# EAGLE design BB8_Head (EAGLE 9.2.2)
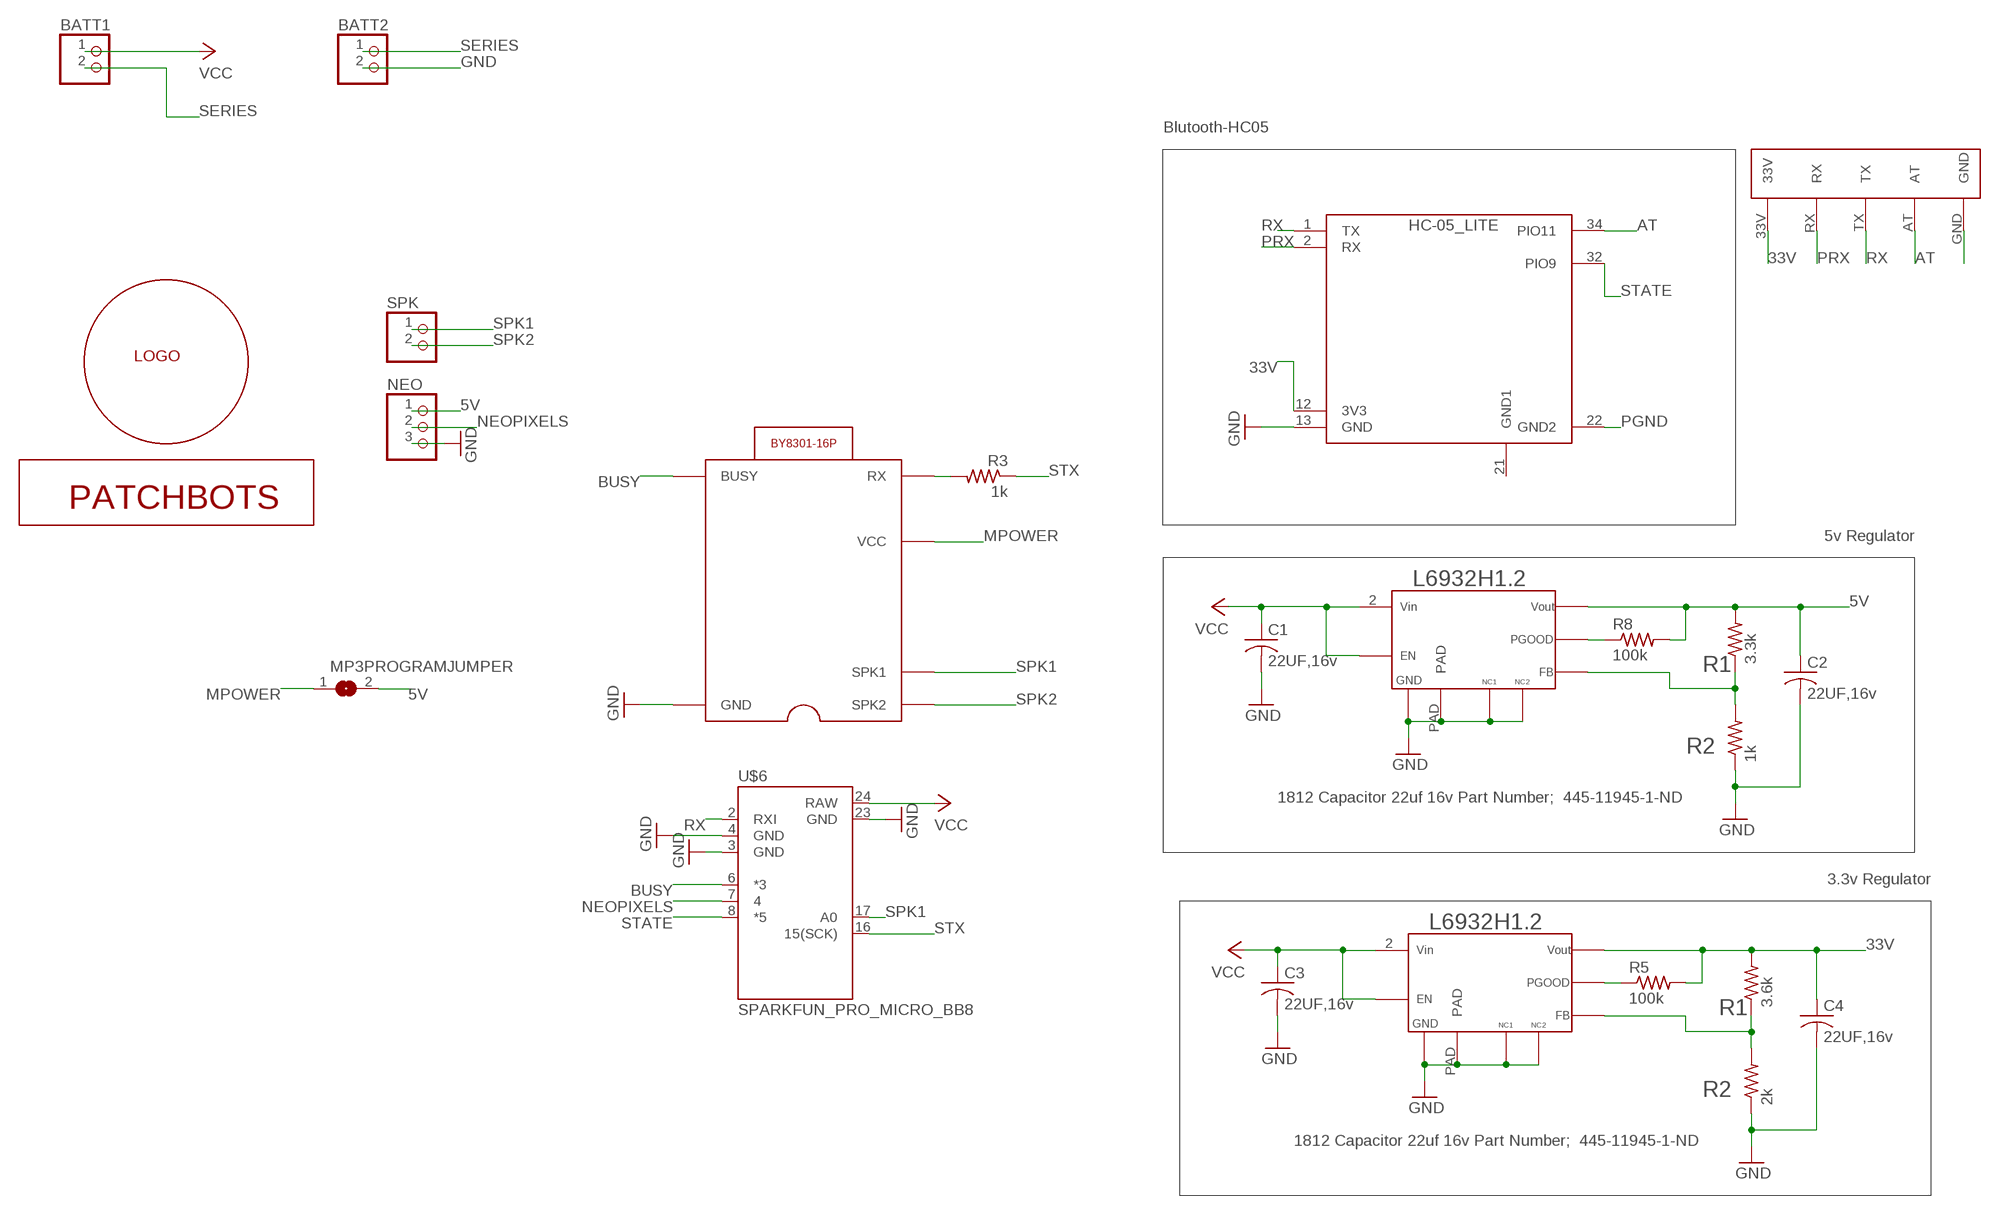
[diagram p0: schematic, sheet 1]

## Parts
BATT1  PINHD-1X2  [1X02]
BATT2  PINHD-1X2  [1X02]
C1  22UF,16v  C-USC1812  [C1812]
C2  22UF,16v  C-USC1812  [C1812]
C3  22UF,16v  C-USC1812  [C1812]
C4  22UF,16v  C-USC1812  [C1812]
HC-05  HC-05_LITE  [BLUETOOTH_SMD_LITE]
MP3PROGRAMJUMPER  SJ  [SJ]
NEO  PINHD-1X3  [1X03]
R1  3.3k  R-US_R2010  [R2010]
R3  1k  R-US_R2010  [R2010]
R5  100k  R-US_R2010  [R2010]
R6  3.6k  R-US_R2010  [R2010]
R7  2k  R-US_R2010  [R2010]
R8  100k  R-US_R2010  [R2010]
R9  1k  R-US_R2010  [R2010]
SPK  PINHD-1X2  [1X02]
U$2  LOGO_15MM-MIXED  [LOGO_15MM_MIXED]
U$3  L6932H1.2  [L6932H1]
U$4  PATCHBOTS_SPLIT15MM  [PATCHBOTS_SPLIT15MM]
U$5  L6932H1.2  [L6932H1]
U$6  SPARKFUN_PRO_MICRO_BB8  [SPARKFUN_PRO_MICRO_BB8]
U$7  PROGRAMMER  [BLUETOOTH_SMD_PROGRAMMER]
U$8  BY8301_BB8  [BY8301-16P_BB8]

## Nets
5V: C2.1 MP3PROGRAMJUMPER.2 NEO.1 R1.2 R8.2 U$3.4
33V: C4.1 HC-05.12(3V3) R5.2 R6.2 U$5.4 U$7.33V
AT: HC-05.34(PIO11) U$7.AT
BUSY: U$6.6(*3) U$8.BUSY
GND: BATT2.2 C1.2 C2.2 C3.2 C4.2 HC-05.13(GND) NEO.3 R7.1 R9.1 U$3.6 U$3.7 U$3.8 U$3.PAD U$5.6 U$5.7 U$5.8 U$5.PAD U$6.3(GND) U$6.4(GND) U$6.23(GND) U$8.GND
MPOWER: MP3PROGRAMJUMPER.1 U$8.VCC
N$1: R1.1 R9.2 U$3.3
N$3: R8.1 U$3.5
N$6: R5.1 U$5.5
N$7: R6.1 R7.2 U$5.3
N$11: R3.2 U$8.RX
NEOPIXELS: NEO.2 U$6.7
PGND: HC-05.22(GND2) U$7.GND
PRX: HC-05.2(RX) U$7.RX
RX: HC-05.1(TX) U$6.2(RXI) U$7.TX
SERIES: BATT1.2 BATT2.1
SPK1: SPK.1 U$6.17(A0) U$8.SPK1
SPK2: SPK.2 U$8.SPK2
STATE: HC-05.32(PIO9) U$6.8(*5)
STX: R3.1 U$6.16(15(SCK))
VCC: BATT1.1 C1.1 C3.1 U$3.1 U$3.2 U$5.1 U$5.2 U$6.24(RAW)
Unconnected: HC-05.21(GND1)

## Notes on the sheet
- Blutooth-HC05
- 5v Regulator
- R1
- R2
- 1812 Capacitor 22uf 16v Part Number;  445-11945-1-ND
- 3.3v Regulator
- R1
- R2
- 1812 Capacitor 22uf 16v Part Number;  445-11945-1-ND

## Library data of the parts
BATT1 BATT2 SPK = pinhead:PINHD-1X2: PIN HEADER
C1-C4 = adafruit:C-US: CAPACITOR, American symbol
HC-05 = HC-05:HC-05_LITE
MP3PROGRAMJUMPER = jumper:SJ: SMD solder JUMPER
NEO = pinhead:PINHD-1X3: PIN HEADER
R1 R3 R5-R9 = adafruit:R-US_: RESISTOR, American symbol
U$2 = LOGO:LOGO_15MM-MIXED
U$3 U$5 = L6932H12:L6932H1.2
U$4 = LOGO:PATCHBOTS_SPLIT15MM
U$6 = SparkFun-Boards:SPARKFUN_PRO_MICRO_BB8
U$7 = HC-05:PROGRAMMER
U$8 = BY8301-16P_MP3Player:BY8301_BB8

## Board
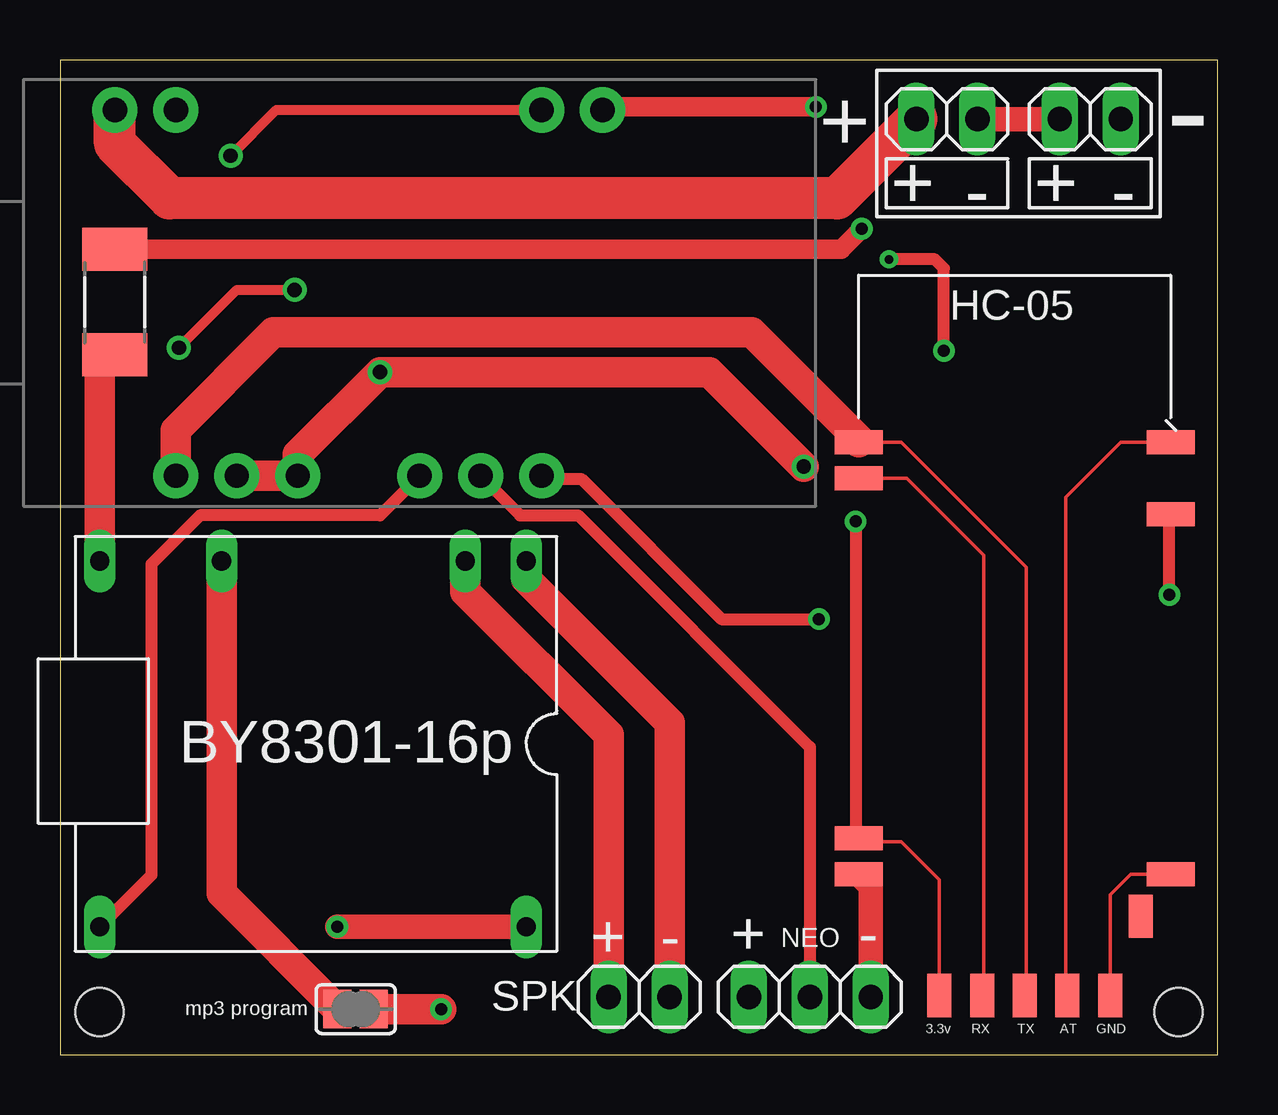
[diagram p1: board, top side]
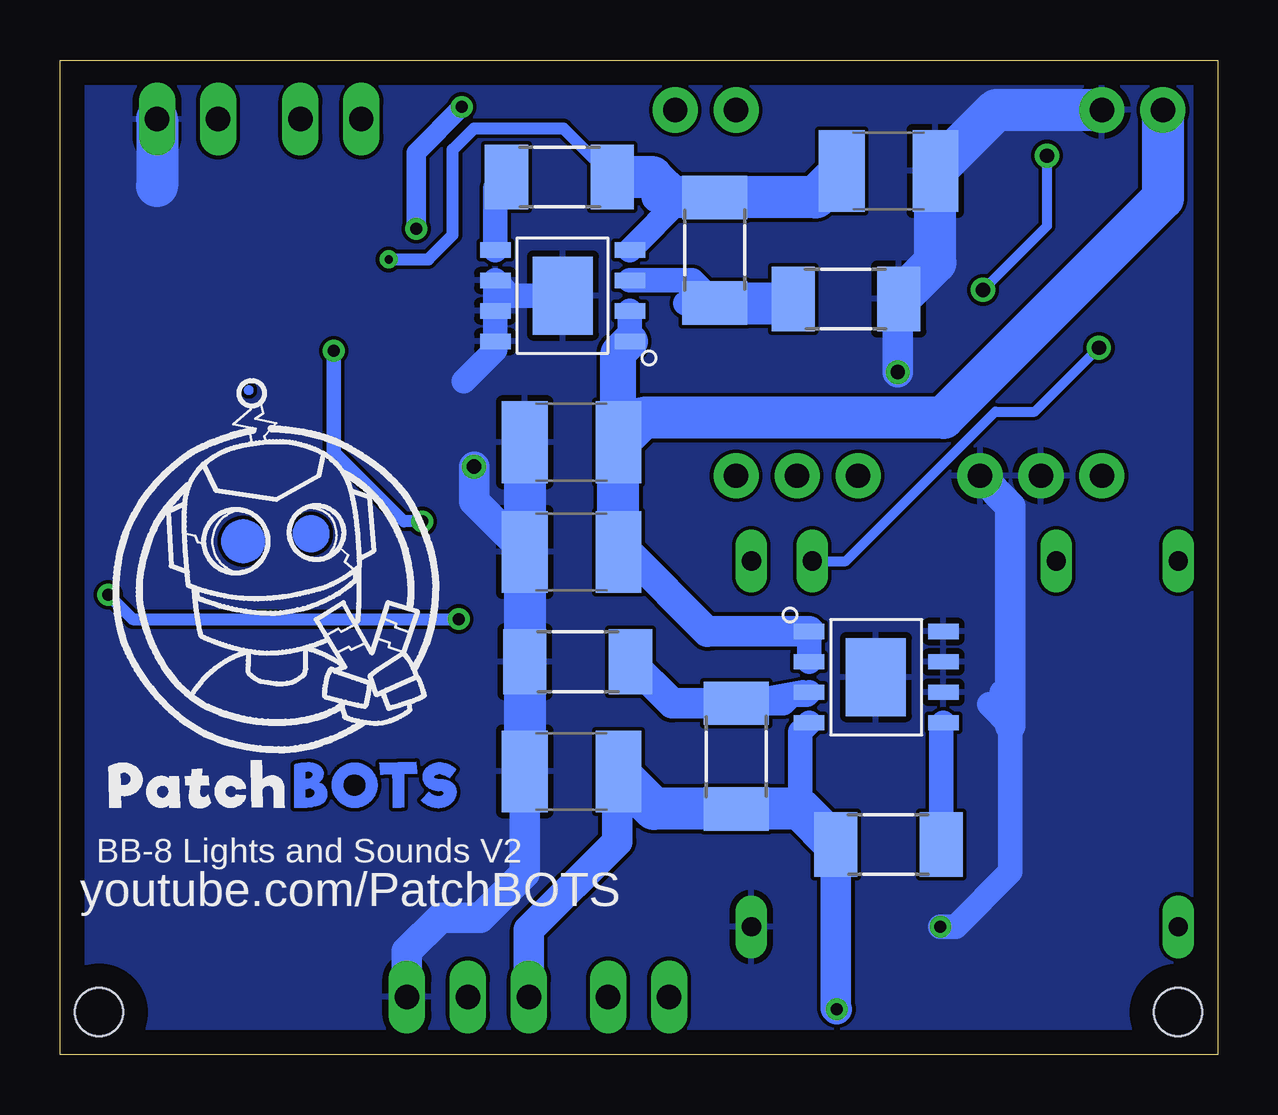
[diagram p2: board, bottom side, seen from below]

Size 48.24 x 41.45 mm. Coordinates in mm from the lower left corner, seen from the top.
Outline: 0,0 48.24,0 48.24,41.45 0,41.45 0,0
Copper layers (1*16): Top 0.035mm / dielectric 1.5mm / Bottom 0.035mm
Design rules "default": minimum track width 6mil, minimum drill 0.35mm, track to track 6mil, track to pad 6mil, pad to pad 6mil, via to via 6mil, smd to smd 6mil, copper to edge 40mil, drill to drill 6mil, minimum pad ring 10mil, minimum via ring 8mil, stop-mask expansion 4mil, vias tented up to drill 0mil, thermal gap 10mil
Holes 2 mm at 1.65,1.78 46.61,1.78

### Footprints (pad centres in the part's own frame; a part is rotated, then mirrored left to right if it is on the bottom)
1X02 = drill 1.016 long: 1 -1.27,0; 2 1.27,0
C1812 = smd 1.9 x 3.4: 1 -1.95,0; 2 1.95,0
BLUETOOTH_SMD_LITE = smd 2 x 1: 1 -6.35,3.81; 2 -6.35,2.31; 12 -6.35,-12.69; 13 -6.35,-14.19; 22 6.65,-14.19; 32 6.65,0.81; 34 6.65,3.81 | smd 1 x 1.8: 21 5.4,-15.94
SJ = smd 1.168 x 1.6: 1 -0.762,0; 2 0.762,0
1X03 = drill 1.016 long: 1 -2.54,0; 2 0,0; 3 2.54,0
R2010 = smd 1.8 x 2.7: 1 -2.2,0; 2 2.2,0
L6932H1 = smd 0.635 x 1.27: 1 4.31,0.9; 2 3.04,0.9; 3 1.77,0.9; 4 0.5,0.9; 5 0.5,-4.7; 6 1.77,-4.7; 7 3.04,-4.7; 8 4.31,-4.7 | smd 3.25 x 2.5: PAD 2.4,-1.886
SPARKFUN_PRO_MICRO_BB8 = drill 1.016 pad 1.88: 2 -7.62,10.16; 3 -7.62,7.62; 4 -7.62,5.08; 6 -7.62,0; 7 -7.62,-2.54; 8 -7.62,-5.08; 16 7.62,-7.62; 17 7.62,-5.08; 23 7.62,10.16; 24 7.62,12.7
BLUETOOTH_SMD_PROGRAMMER = smd 1 x 1.8: 33V -3.49,-1.462; AT 1.844,-1.462; GND 3.622,-1.462; RX -1.712,-1.462; TX 0.066,-1.462
BY8301-16P_BB8 = drill 0.8 long: BUSY 0,0; GND 0,-17.78; RX 15.24,0; SPK1 15.24,-15.24; SPK2 15.24,-17.78; VCC 15.24,-5.08

### Placement (x,y rotation side)
BATT1  36.96,38.99 0 top
BATT2  42.93,38.99 0 top
C1  26.92,20.95 180 bottom
C2  26.92,11.81 180 bottom
C3  26.92,25.53 180 bottom
C4  13.72,36.83 0 bottom
HC-05  39.62,21.72 0 top
MP3PROGRAMJUMPER  12.32,1.91 0 top
NEO  31.24,2.41 0 top
R1  20.07,12.45 270 bottom
R3  2.29,31.37 270 top
R5  27.43,36.58 0 bottom
R6  20.95,33.53 90 bottom
R7  15.49,31.5 180 bottom
R8  13.72,8.76 180 bottom
R9  26.67,16.38 0 bottom
SPK  24.13,2.41 0 top
U$2  47.12,11.81 0 bottom
U$3  16.13,13.34 90 bottom
U$4  45.97,10.03 0 bottom
U$5  25.4,34.04 270 bottom
U$6  14.99,31.75 90 top
U$7  40.13,3.94 0 top
U$8  1.65,5.33 90 top

### Tracks (layer width: path | path; a pad name or v marks a point on that pad's centre or on a via)
5V  (via drill 0.5)
  Top 1.27: v15.88,1.91 MP3PROGRAMJUMPER.2
  Bottom 1.016: U$3.4 17.4,13.47 17.4,10.25
  Bottom 1.27: NEO.1 28.7,5.21 25.02,8.89 25.02,11.77 C2.1 | v15.88,1.91 15.92,1.95 R8.2 16.38,9.23
  Bottom 1.75: R8.2 17.4,10.25 R1.2 23.5,10.25 25.02,11.77
33V  (via drill 0.35, 0.5)
  Top 0.152: HC-05.12 33.41,8.89 35.05,8.89 36.64,7.3 U$7.33V
  Top 0.508: v33.15,22.23 33.15,9.15 HC-05.12 | v36.83,29.34 36.83,32.77 36.45,33.15 v34.54,33.15
  Bottom 0.508: v33.15,22.23 33.91,22.23 36.83,25.15 | v34.54,33.15 32.89,33.15 31.88,34.16 31.88,37.72 30.99,38.61 27.26,38.61 R5.2
  Bottom 0.61: 36.83,25.15 v36.83,29.34
  Bottom 1.016: U$5.4 22.31,35.73 R6.2
  Bottom 1.27: 23.37,35.73 R6.2
  Bottom 1.75: C4.1 16.77,35.73 R6.2 22.73,35.73 23.58,36.58 R5.2
AT
  Top 0.152: HC-05.34 44.2,25.53 41.91,23.24 41.91,2.54 U$7.AT
BUSY
  Top 0.508: U$6.6 13.34,22.48 5.84,22.48 3.81,20.45 3.81,7.49 U$8.BUSY
GND  (via drill 0.5, 0.6)
  Top 1.016: NEO.3 33.78,7.02 HC-05.13 | U$8.GND v11.56,5.33
  Top 1.27: U$6.3 U$6.4 9.91,25.02 v13.34,28.45 27.05,28.45 v30.99,24.51
  Bottom 1.016: v11.56,5.33 10.92,5.33 8.64,7.62 8.64,13.72 9.53,14.61 | U$5.PAD 29.47,31.64 U$5.6 U$5.8 30.1,29.38 31.41,28.07 | 9.01,15.11 8.64,14.73 | 14.48,16.26 14.48,15.97 U$3.PAD
  Bottom 1.27: C2.2 28.87,7.58 30.73,5.72 32.38,5.72 33.78,4.32 NEO.3 | U$6.4 8.64,22.86 8.64,14.73 8.64,13.72 | R7.1 13.34,31.45 v13.34,28.45 | v30.99,24.51 30.99,23.07 C1.2
  Bottom 1.75: BATT2.2 44.2,36.2 | C3.2 C1.2 R9.1 C2.2 | R7.1 11.77,33.02 C4.2 9.23,39.37 U$6.23
  pour Bottom: 48.01,41.91 48.51,41.4 48.51,-0.25 48.13,-0.63 0.13,-0.63 -0.38,-0.13 -0.38,41.66
MPOWER
  Top 1.27: MP3PROGRAMJUMPER.1 6.73,6.73 U$8.VCC
N$1
  Bottom 1.016: 17.28,15.11 20.02,14.61 | U$3.3 17.13,15 17.75,15 18.1,14.65 R1.1
  Bottom 1.27: 20.02,14.61 R1.1 22.73,14.65 R9.2
N$3
  Bottom 1.016: R8.1 11.52,13.75 U$3.5
N$6
  Bottom 1.016: U$5.5 30.1,36.11 R5.1
N$7
  Bottom 1.016: 22.18,31.33 R6.1 21.89,32.27 U$5.3 | R7.2 17.86,31.33
  Bottom 1.75: R6.1 17.86,31.33 17.82,31.37
N$11
  Top 1.27: U$8.RX 1.65,28.53 R3.2
NEOPIXELS
  Top 0.508: U$6.7 19.18,22.48 21.59,22.48 31.24,12.83 NEO.2
PGND
  Top 0.152: HC-05.22 44.61,7.53 44.58,7.49 43.75,6.67 U$7.GND
PRX
  Top 0.152: HC-05.2 35.28,24.03 38.48,20.83 38.48,2.54 U$7.RX
RX
  Top 0.152: HC-05.1 35.05,25.53 40.26,20.32 40.26,2.54 U$7.TX
  Top 1.27: U$6.2 4.83,26.03 8.89,30.1 28.83,30.1 33.27,25.65 HC-05.1
SERIES
  Top 1.016: BATT1.2 BATT2.1
SPK1  (via drill 0.6)
  Top 0.406: v4.95,29.46 7.37,31.88 v9.78,31.88 | v7.11,37.47 9.02,39.37 U$6.17
  Top 1.27: U$8.SPK1 16.89,19.3 22.86,13.34 SPK.1
  Bottom 0.406: U$8.SPK1 15.49,20.57 9.27,26.8 7.62,26.8 v4.95,29.46 | v9.78,31.88 7.11,34.54 v7.11,37.47
SPK2
  Top 1.27: U$8.SPK2 19.43,19.81 25.4,13.84 SPK.2
STATE  (via drill 0.5)
  Top 0.508: U$6.8 20.19,24 21.72,24 27.56,18.16 v31.62,18.16 | v46.23,19.18 46.23,22.73 46.27,22.78 HC-05.32
  Bottom 0.508: v31.62,18.16 45.21,18.16 v46.23,19.18
STX  (via drill 0.5)
  Top 0.813: R3.1 32.55,33.57 v33.4,34.42 | v31.5,39.5 22.73,39.5 U$6.16
  Bottom 0.813: v33.4,34.42 33.4,37.59 v31.5,39.5
VCC
  Top 1.75: BATT1.1 32.38,35.69 4.57,35.69 2.29,37.97 U$6.24
  Bottom 1.016: 24.13,26.37 C3.1 | U$3.2 U$3.1 | U$5.1 U$5.2
  Bottom 1.27: U$3.1 21.1,17.64 21.26,17.62 24.59,20.95 C1.1
  Bottom 1.5: C3.1 24.97,29.25 U$5.1
  Bottom 1.75: U$6.24 2.29,35.69 11.43,26.54 23.96,26.54 C3.1 C1.1

### Text on the board
bPlace: youtube.com/PatchBOTS
tNames: - | + | - | - | + | + | + | - | + | - | mp3 program | 3.3v | RX | TX | AT | GND
bNames: BB-8 Lights and Sounds V2